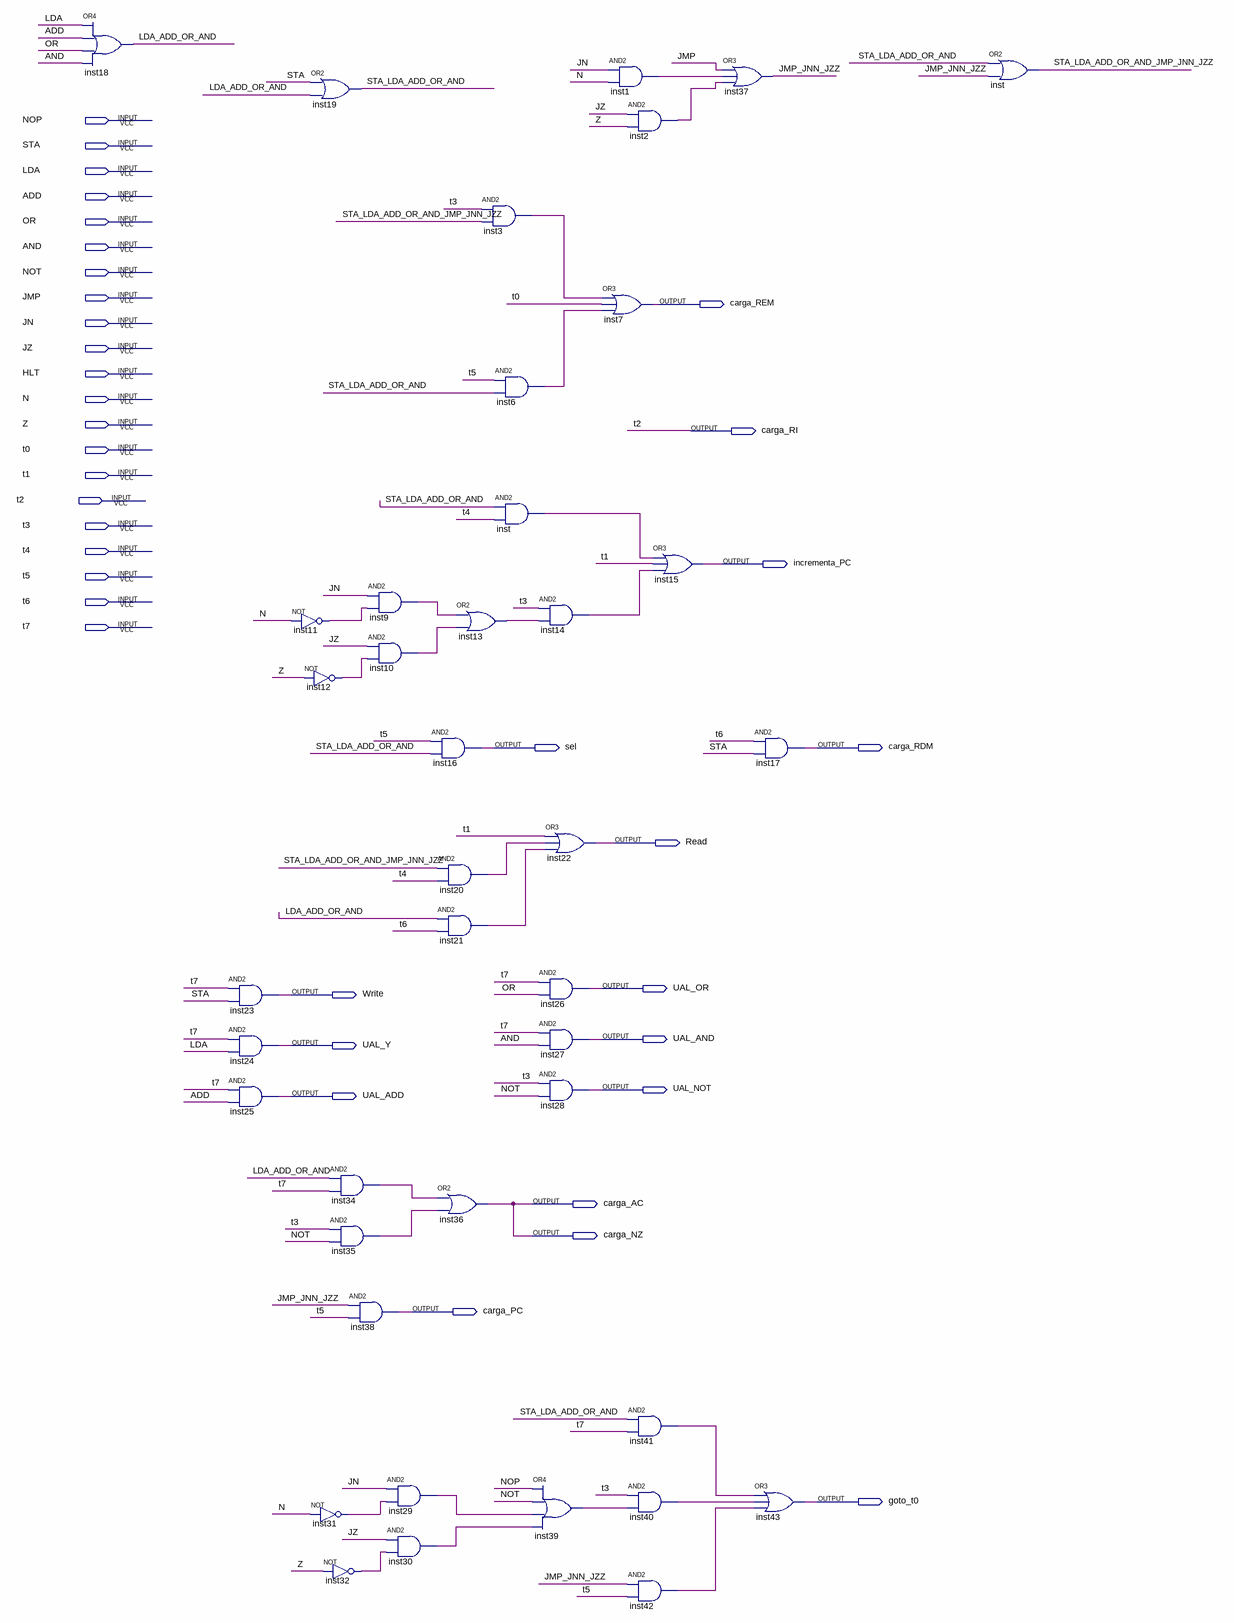
[diagram p0: schematic sheet]
// Quartus schematic ControlUnit.bdf as structural Verilog: 41 symbols, 37 pins
module ControlUnit (
  input  NOP,
  input  STA,
  input  LDA,
  input  ADD,
  input  OR,
  input  AND,
  input  NOT,
  input  JMP,
  input  JN,
  input  JZ,
  input  HLT,
  input  N,
  input  Z,
  input  t0,
  input  t1,
  input  t2,
  input  t3,
  input  t4,
  input  t5,
  input  t6,
  input  t7,
  output carga_REM,
  output carga_RI,
  output incrementa_PC,
  output sel,
  output carga_RDM,
  output Read,
  output UAL_OR,
  output Write,
  output UAL_AND,
  output UAL_Y,
  output UAL_NOT,
  output UAL_ADD,
  output carga_AC,
  output carga_NZ,
  output carga_PC,
  output goto_t0
);

  wire inst1_out, inst2_out, inst3_out, inst6_out, inst9_out, inst10_out, inst11_out, inst12_out, inst13_out,
       inst14_out, inst20_out, inst21_out, inst29_out, inst30_out, inst31_out, inst32_out, inst34_out,
       inst35_out, inst39_out, inst40_out, inst41_out, inst42_out, inst_out, JMP_JNN_JZZ, LDA_ADD_OR_AND,
       STA_LDA_ADD_OR_AND, STA_LDA_ADD_OR_AND_JMP_JNN_JZZ;

  or inst18 (LDA_ADD_OR_AND, LDA, ADD, OR, AND);
  and inst23 (Write, t7, STA);
  and inst24 (UAL_Y, t7, LDA);
  and inst25 (UAL_ADD, t7, ADD);
  or inst19 (STA_LDA_ADD_OR_AND, STA, LDA_ADD_OR_AND);
  not inst11 (inst11_out, N);
  not inst12 (inst12_out, Z);
  not inst31 (inst31_out, N);
  and inst34 (inst34_out, LDA_ADD_OR_AND, t7);
  and inst35 (inst35_out, t3, NOT);
  and inst38 (carga_PC, JMP_JNN_JZZ, t5);
  not inst32 (inst32_out, Z);
  and inst9 (inst9_out, JN, inst11_out);
  and inst10 (inst10_out, JZ, inst12_out);
  and inst29 (inst29_out, JN, inst31_out);
  and inst30 (inst30_out, JZ, inst32_out);
  or inst13 (inst13_out, inst9_out, inst10_out);
  and inst16 (sel, t5, STA_LDA_ADD_OR_AND);
  and inst20 (inst20_out, STA_LDA_ADD_OR_AND_JMP_JNN_JZZ, t4);
  and inst21 (inst21_out, LDA_ADD_OR_AND, t6);
  or inst36 (carga_AC, inst34_out, inst35_out);
  and inst3 (inst3_out, t3, STA_LDA_ADD_OR_AND_JMP_JNN_JZZ);
  and inst6 (inst6_out, t5, STA_LDA_ADD_OR_AND);
  and inst (inst_out, STA_LDA_ADD_OR_AND, t4);
  and inst14 (inst14_out, t3, inst13_out);
  or inst22 (Read, t1, inst20_out, inst21_out);
  and inst26 (UAL_OR, t7, OR);
  and inst27 (UAL_AND, t7, AND);
  and inst28 (UAL_NOT, t3, NOT);
  or inst39 (inst39_out, NOP, NOT, inst29_out, inst30_out);
  and inst1 (inst1_out, JN, N);
  or inst7 (carga_REM, inst3_out, t0, inst6_out);
  and inst2 (inst2_out, JZ, Z);
  or inst15 (incrementa_PC, inst_out, t1, inst14_out);
  and inst41 (inst41_out, STA_LDA_ADD_OR_AND, t7);
  and inst40 (inst40_out, t3, inst39_out);
  and inst42 (inst42_out, JMP_JNN_JZZ, t5);
  or inst37 (JMP_JNN_JZZ, JMP, inst1_out, inst2_out);
  and inst17 (carga_RDM, t6, STA);
  or inst43 (goto_t0, inst41_out, inst40_out, inst42_out);
  or inst_dup2 (STA_LDA_ADD_OR_AND_JMP_JNN_JZZ, STA_LDA_ADD_OR_AND, JMP_JNN_JZZ);

  assign carga_NZ = carga_AC;
  assign carga_RI = t2;
endmodule
